# Altium schematic sheet Mini-DSO.SchDoc
size A3; SheetNumber: 2; SheetTotal: 7
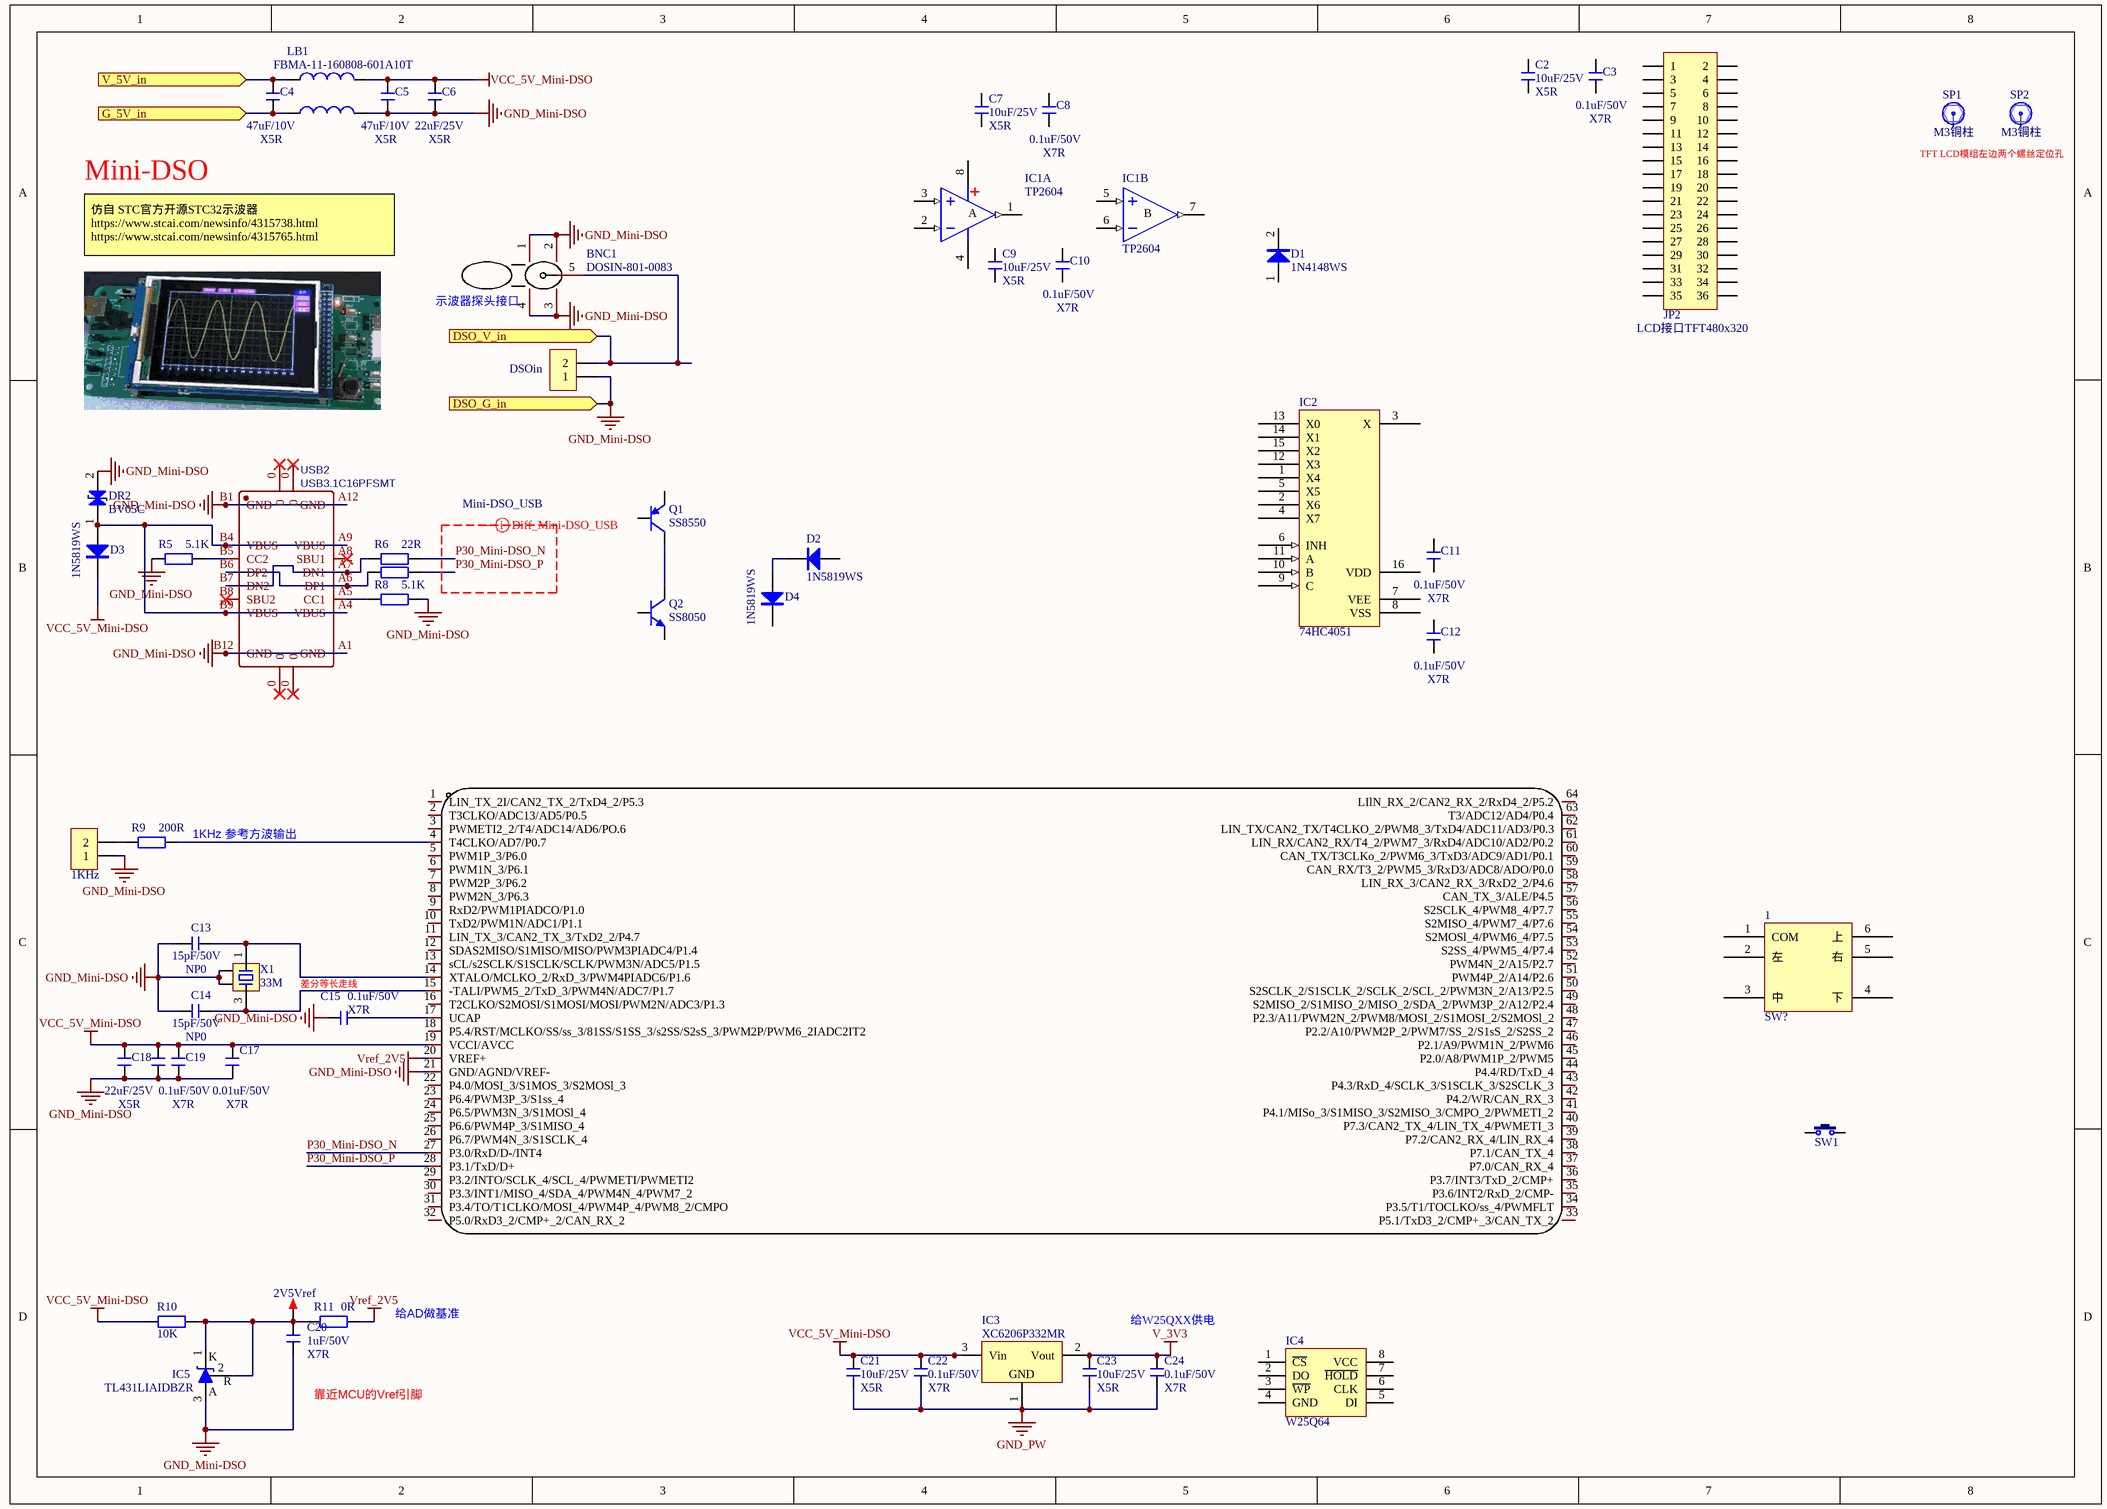
[diagram p0: Mini-DSO.SchDoc]

## Parts
1  SW?  [TSW 10x10x9-5Key-LS]
BNC1  DOSIN-801-0083  [BNC-TH_DOSIN-801-0083]
C2  10uF/25V  BOM名称: X5R  [C 0603_L]
C3  0.1uF/50V  BOM名称: X7R  [C 0402_L]
C4  47uF/10V  BOM名称: X5R  [C 1206_L]
C5  47uF/10V  BOM名称: X5R  [C 1206_L]
C6  22uF/25V  BOM名称: X5R  [C 0805_L]
C7  10uF/25V  BOM名称: X5R  [C 0603_L]
C8  0.1uF/50V  BOM名称: X7R  [C 0402_L]
C9  10uF/25V  BOM名称: X5R  [C 0603_L]
C10  0.1uF/50V  BOM名称: X7R  [C 0402_L]
C11  0.1uF/50V  BOM名称: X7R  [C 0402_L]
C12  0.1uF/50V  BOM名称: X7R  [C 0402_L]
C13  15pF/50V  BOM名称: NP0  [C 0402_L]
C14  15pF/50V  BOM名称: NP0  [C 0402_L]
C15  0.1uF/50V  BOM名称: X7R  [C 0402_L]
C16  0.1uF/50V  [C 0402_L]  (value not drawn)
C17  0.01uF/50V  BOM名称: X7R  [C 0402_L]
C18  22uF/25V  BOM名称: X5R  [C 0805_L]
C19  0.1uF/50V  BOM名称: X7R  [C 0402_L]
C20  1uF/50V  BOM名称: X7R  [C 0603_L]
C21  10uF/25V  BOM名称: X5R  [C 0603_L]
C22  0.1uF/50V  BOM名称: X7R  [C 0402_L]
C23  10uF/25V  BOM名称: X5R  [C 0603_L]
C24  0.1uF/50V  BOM名称: X7R  [C 0402_L]
D1  1N4148WS  [SOD-323]
D2  1N5819WS  [SOD-323]
D3  1N5819WS  [SOD-323]
D4  1N5819WS  [SOD-323]
DR2  BV05C  [SOD-323]
IC1  TP2604  [SOP8_N]  (parts A,B of 2)
IC2  74HC4051  [SOP16_N]
IC3  XC6206P332MR  [SOT23-3N]
IC4  W25Q64  [SOP8W_N]
IC5  TL431LIAIDBZR  [SOT23-3N]
JP1  DSOin  [HDR2.54-WS-2P]
JP2  LCD接口TFT480x320  [HDR2.54-LI-2x18P]
JP3  1KHz  [HDR2.54-WS-2P]
LB1  FBMA-11-160808-601A10T  [FB 0603_L]
LB2  FBMA-11-160808-601A10T  [FB 0603_L]  (value not drawn)
Q1  SS8550  [SOT23-3N]
Q2  SS8050  [SOT23-3N]
R5  5.1K  [R 0402_L]
R6  22R  [R 0402_L]
R7  22R  [R 0402_L]  (value not drawn)
R8  5.1K  [R 0402_L]
R9  200R  [R 0402_L]
R10  10K  [R 0402_L]
R11  0R  [R 0402_L]
SP1  M3铜柱  [M3x4_L]
SP2  M3铜柱  [M3x4_L]
SW1  3x6x5  [TSW SMD-3*6*2.5]  (value not drawn)
TP3  2V5Vref  [TEST 1]
U1  STC32G12K128-Beta-LQFP64  [LQFP64 14x14_N]  (value not drawn)
USB2  USB3.1C16PFSMT  [TYPE-C-USB-17]
X1  33M  [OSC 3225-4P]

## Ports
DSO_G_in (in), DSO_V_in (in), G_5V_in (in), V_5V_in (in)

## Nets
GND_Mini-DSO: BNC1.1 BNC1.2 BNC1.3 BNC1.4 C5.1 C6.1 C13.2 C14.2 C15.2 C16.2 C17.2 C18.1 C19.2 C20.1 DR2.2(K) IC5.3(A) JP1.1 JP3.1 LB2.2 R5.2 R8.1 U1.21(GND/AGND/VREF-) USB2.A1(GND) USB2.A12(GND) USB2.B1(GND) USB2.B12(GND) X1.2 X1.4 ; port DSO_G_in
GND_PW: C21.1 C22.2 C23.1 C24.2 IC3.1(GND)
V_3V3: C23.2 C24.1 IC3.2(Vout)
VCC_5V_Mini-DSO: C5.2 C6.2 C16.1 C17.1 C18.2 C19.1 C21.2 C22.1 D3.2(K) IC3.3(Vin) LB1.2 R10.2 U1.19(VCCI/AVCC)
Vref_2V5: R11.2 U1.20(VREF+)
DSO_V_in: BNC1.5 JP1.2 ; port DSO_V_in
G_5V_in: C4.1 LB2.1 ; port G_5V_in
P30_Mini-DSO_N: R6.1 U1.27(P3.0/RxD/D-/INT4)
P30_Mini-DSO_P: R7.1 U1.28(P3.1/TxD/D+)
V_5V_in: C4.2 LB1.1 ; port V_5V_in
NetC13_1: C13.1 U1.14(XTALO/MCLKO_2/RxD_3/PWM4PIADC6/P1.6) X1.1
NetC14_1: C14.1 U1.15(-TALI/PWM5_2/TxD_3/PWM4N/ADC7/P1.7) X1.3
NetC15_1: C15.1 U1.17(UCAP)
NetC20_2: C20.2 IC5.1(K) IC5.2(R) R10.1 R11.1 TP3.1
NetD2_2: D2.2(K) D4.1(A)
NetD3_1: D3.1(A) DR2.1(A) USB2.A4(VBUS) USB2.A9(VBUS) USB2.B4(VBUS) USB2.B9(VBUS)
NetJP3_2: JP3.2 R9.2
NetQ1_3: Q1.3(C) Q2.3(C)
NetR5_1: R5.1 USB2.B5(CC2)
NetR6_2: R6.2 USB2.A7(DN1) USB2.B7(DN2)
NetR7_2: R7.2 USB2.A6(DP1) USB2.B6(DP2)
NetR8_2: R8.2 USB2.A5(CC1)
NetR9_1: R9.1 U1.4(T4CLKO/AD7/P0.7)

Not connected (* = marked no-connect by the designer): 1 1(COM) 2(左) 3(中) 4(下) 5(右) 6(上); C2 1 2; C3 1 2; C7 1 2; C8 1 2; C9 1 2; C10 1 2; C11 1 2; C12 1 2; D1 1(A) 2(K); D2 1(A); D4 2(K); IC1 1(OUT) 2(IN-) 3(IN+) 4(V-) 5(IN+) 6(IN-) 7(OUT) 8(V+); IC2 1(X4) 2(X6) 3(X) 4(X7) 5(X5) 6(INH) 7(VEE) 8(VSS) 9(C) 10(B) 11(A) 12(X3) 13(X0) 14(X1) 15(X2) 16(VDD); IC4 1(~{CS}) 2(DO) 3(~{WP}) 4(GND) 5(DI) 6(CLK) 7(~{HOLD}) 8(VCC); JP2 1 2 3 4 5 6 7 8 9 10 11 12 13 14 15 16 17 18 19 20 21 22 23 24 25 26 27 28 29 30 31 32 33 34 35 36; Q1 1(B) 2(E); Q2 1(B) 2(E); SP1 1; SP2 1; SW1 1 2; U1 1(LIN_TX_2I/CAN2_TX_2/TxD4_2/P5.3) 2(T3CLKO/ADC13/AD5/P0.5) 3(PWMETI2_2/T4/ADC14/AD6/PO.6) 5(PWM1P_3/P6.0) 6(PWM1N_3/P6.1) 7(PWM2P_3/P6.2) 8(PWM2N_3/P6.3) 9(RxD2/PWM1PIADCO/P1.0) 10(TxD2/PWM1N/ADC1/P1.1) 11(LIN_TX_3/CAN2_TX_3/TxD2_2/P4.7) 12(SDAS2MISO/S1MISO/MISO/PWM3PIADC4/P1.4) 13(sCL/s2SCLK/S1SCLK/SCLK/PWM3N/ADC5/P1.5) 16(T2CLKO/S2MOSI/S1MOSI/MOSI/PWM2N/ADC3/P1.3) 18(P5.4/RST/MCLKO/SS/ss_3/81SS/S1SS_3/s2SS/S2sS_3/PWM2P/PWM6_2IADC2IT2) 22(P4.0/MOSI_3/S1MOS_3/S2MOSl_3) 23(P6.4/PWM3P_3/S1ss_4) 24(P6.5/PWM3N_3/S1MOSl_4) 25(P6.6/PWM4P_3/S1MISO_4) 26(P6.7/PWM4N_3/S1SCLK_4) 29(P3.2/INTO/SCLK_4/SCL_4/PWMETI/PWMETI2) 30(P3.3/INT1/MISO_4/SDA_4/PWM4N_4/PWM7_2) 31(P3.4/TO/T1CLKO/MOSI_4/PWM4P_4/PWM8_2/CMPO) 32(P5.0/RxD3_2/CMP+_2/CAN_RX_2) 33(P5.1/TxD3_2/CMP+_3/CAN_TX_2) 34(P3.5/T1/TOCLKO/ss_4/PWMFLT) 35(P3.6/INT2/RxD_2/CMP-) 36(P3.7/INT3/TxD_2/CMP+) 37(P7.0/CAN_RX_4) 38(P7.1/CAN_TX_4) 39(P7.2/CAN2_RX_4/LIN_RX_4) 40(P7.3/CAN2_TX_4/LIN_TX_4/PWMETI_3) 41(P4.1/MISo_3/S1MISO_3/S2MISO_3/CMPO_2/PWMETI_2) 42(P4.2/WR/CAN_RX_3) 43(P4.3/RxD_4/SCLK_3/S1SCLK_3/S2SCLK_3) 44(P4.4/RD/TxD_4) 45(P2.0/A8/PWM1P_2/PWM5) 46(P2.1/A9/PWM1N_2/PWM6) 47(P2.2/A10/PWM2P_2/PWM7/SS_2/S1sS_2/S2SS_2) 48(P2.3/A11/PWM2N_2/PWM8/MOSI_2/S1MOSI_2/S2MOSl_2) 49(S2MISO_2/S1MISO_2/MISO_2/SDA_2/PWM3P_2/A12/P2.4) 50(S2SCLK_2/S1SCLK_2/SCLK_2/SCL_2/PWM3N_2/A13/P2.5) 51(PWM4P_2/A14/P2.6) 52(PWM4N_2/A15/P2.7) 53(S2SS_4/PWM5_4/P7.4) 54(S2MOSl_4/PWM6_4/P7.5) 55(S2MISO_4/PWM7_4/P7.6) 56(S2SCLK_4/PWM8_4/P7.7) 57(CAN_TX_3/ALE/P4.5) 58(LIN_RX_3/CAN2_RX_3/RxD2_2/P4.6) 59(CAN_RX/T3_2/PWM5_3/RxD3/ADC8/ADO/P0.0) 60(CAN_TX/T3CLKo_2/PWM6_3/TxD3/ADC9/AD1/P0.1) 61(LIN_RX/CAN2_RX/T4_2/PWM7_3/RxD4/ADC10/AD2/P0.2) 62(LIN_TX/CAN2_TX/T4CLKO_2/PWM8_3/TxD4/ADC11/AD3/P0.3) 63(T3/ADC12/AD4/P0.4) 64(LIlN_RX_2/CAN2_RX_2/RxD4_2/P5.2); USB2 0* A8(SBU1)* B8(SBU2)*

## Layout directives
differential pair; differential pair class Mini-DSO_USB: P30_Mini-DSO_N, P30_Mini-DSO_P

## Notes on the sheet
- Mini-DSO
- TFT LCD模组左边两个螺丝定位孔
- 仿自 STC官方开源STC32示波器
  https://www.stcai.com/newsinfo/4315738.html
  https://www.stcai.com/newsinfo/4315765.html
- (near BNC1) 示波器探头接口
- (near R9) 1KHz 参考方波输出
- (near C15) 差分等长走线
- (near R11) 给AD做基准
- 给W25QXX供电
- 靠近MCU的Vref引脚
- Title
- Start date:
- Revision:
- Sheet
- Last date:
- of
- Organization:
- Drawn by:
- Checked by:
- Size:
- A4
- (in symbol LM358, part A) A
- (in symbol LM358, part B) B

## Library data of the parts
1 = 5Key: 五向按键; BOM名称: 五向按键
BNC1 = BNC插座: 示波器探头插座，DOSIN-801-0083; BOM名称: 示波器探头插座，DOSIN-801-0083
C2 C4-C7 C9 C18 C21 C23 = C X5R: 无极性贴片电容 X5R
C3 C8 C10-C12 C15-C17 C19 C20 C22 C24 = C X7R: 无极性贴片电容 X7R
  C16: BOM名称: X7R
C13 C14 = C NP0: 无极性贴片电容 NP0
D1 = 1N4148: 高速开关二极管; 版权归属: 源创客; BOM名称: 高速开关二极管; 学习资源: www.ooocke.com
D2-D4 = 1N5819: 肖特基二极管; 版权归属: 源创客; 属性: 40V/2A; BOM名称: 肖特基二极管; 学习资源: www.ooocke.com
DR2 = DR: 瞬态电压抑制二极管; 版权归属: 源创客; BOM名称: 瞬态电压抑制二极管; 学习资源: www.ooocke.com
IC1 = LM358: 双路运放; 版权归属: 源创客; BOM名称: 双路运放; 学习资源: www.ooocke.com
IC2 = CD4051: 八选一; BOM名称: 八选一
IC3 = XC6206P332MR: 低压差线性稳压芯片; 版权归属: 源创客; BOM名称: 低压差线性稳压芯片; 学习资源: www.ooocke.com
IC4 = W25Qxx: 外置Flash; 版权归属: 源创客; BOM名称: 外置Flash; 学习资源: www.ooocke.com
IC5 = TL431_SMD: 可调基准稳压芯片; 版权归属: 源创客; BOM名称: 可调基准稳压芯片; 学习资源: www.ooocke.com
JP1 JP3 = Header 2: 2P接插件; 版权归属: 源创客; BOM名称: 2P接插件; 学习资源: www.ooocke.com
JP2 = Header 18X2: 18*2P接插件; 版权归属: 源创客; BOM名称: 18*2P接插件; 学习资源: www.ooocke.com
LB1 LB2 = LB: 磁珠 600R@100MHz; 版权归属: 源创客; BOM名称: 磁珠 600R@100MHz; 学习资源: www.ooocke.com
Q1 = 8550-SMD: 高频放大-PNP型; 版权归属: 源创客; 属性: 40V 1.5A 1W 100MHZ; BOM名称: 高频放大-PNP型; 学习资源: www.ooocke.com
Q2 = 8050-SMD: 高频放大-NPN型; 版权归属: 源创客; 属性: 40V 1.5A 1W 100MHZ; BOM名称: 高频放大-NPN型; 学习资源: www.ooocke.com
R5-R11 = R: 贴片电阻 E-96 1%; BOM名称: E-96 1%
SP1 SP2 = 铜柱小焊盘: 铜柱; 版权归属: 源创客; BOM名称: 铜柱; 学习资源: www.ooocke.com
SW1 = TSW 3x6: 3x6轻触开关; 版权归属: 源创客; BOM名称: 3x6轻触开关; 学习资源: www.ooocke.com
TP3 = TEST: 测试点; 版权归属: 源创客; BOM名称: 测试点; 学习资源: www.ooocke.com
U1 = STC32G12K128-Beta-LQFP64: Manufacturer: STC(宏晶); Add into BOM: yes; Name: STC32G12K128-Beta-LQFP64; Symbol: STC32G12K128-BETA-LQFP64; Device: STC32G12K128-Beta-LQFP64; LCSC Part Name: STC32G12K128-Beta-LQFP64; Supplier Part: C3020367; Manufacturer Part: STC32G12K128-Beta-LQFP64; Supplier Footprint: LQFP-64; JLCPCB Part Class: Extended Part; Datasheet: https://atta.szlcsc.com/upload/public/pdf/source/20220519/F36B7AE14E7682CFD7D7CC400D8CC62F.pdf; Supplier: LCSC; Convert to PCB: yes
X1 = XTAL-4P: 4脚无源晶振; 版权归属: 源创客; BOM名称: 4脚无源晶振; 学习资源: www.ooocke.com